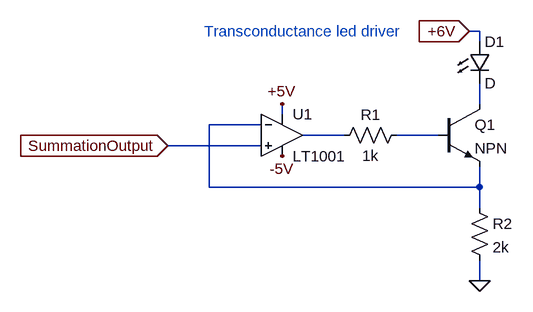
[diagram p0: schematic Draft1.asc]
Draft1.asc, the LTspice schematic file:
Version 4
SHEET 1 880 680
WIRE 560 -16 544 -16
WIRE 560 0 560 -16
WIRE 560 96 560 64
WIRE 256 112 256 96
WIRE 224 128 144 128
WIRE 352 144 288 144
WIRE 496 144 432 144
WIRE 224 160 80 160
WIRE 144 224 144 128
WIRE 560 224 560 192
WIRE 560 224 144 224
WIRE 560 256 560 224
WIRE 560 368 560 336
FLAG 80 160 SummationOutput
IOPIN 80 160 In
FLAG 544 -16 +6V
IOPIN 544 -16 In
FLAG 560 368 0
FLAG 256 176 -5V
FLAG 256 96 +5V
SYMBOL Opamps\\LT1001 256 80 R0
SYMATTR InstName U1
SYMBOL npn 496 96 R0
SYMATTR InstName Q1
SYMBOL res 448 128 R90
WINDOW 0 0 56 VBottom 2
WINDOW 3 32 56 VTop 2
SYMATTR InstName R1
SYMATTR Value 1k
SYMBOL res 544 240 R0
SYMATTR InstName R2
SYMATTR Value 2k
SYMBOL LED 544 0 R0
SYMATTR InstName D1
TEXT 136 -16 Left 2 ;Transconductance led driver

The netlist it stands for:
* Draft1.asc
XU1 SummationOutput N002 +5V -5V N003 LT1001  ; pins In+ In- V+ V- OUT
Q1 N001 N004 N002 0 NPN
R1 N004 N003 1k
R2 N002 0 2k
D1 +6V N001 D
.model D D
.lib standard.dio
.model NPN NPN
.model PNP PNP
.lib standard.bjt
* Transconductance led driver
.lib LTC.lib
.backanno
.end